# EAGLE design SwitchDemoWing (EAGLE 9.4.0)
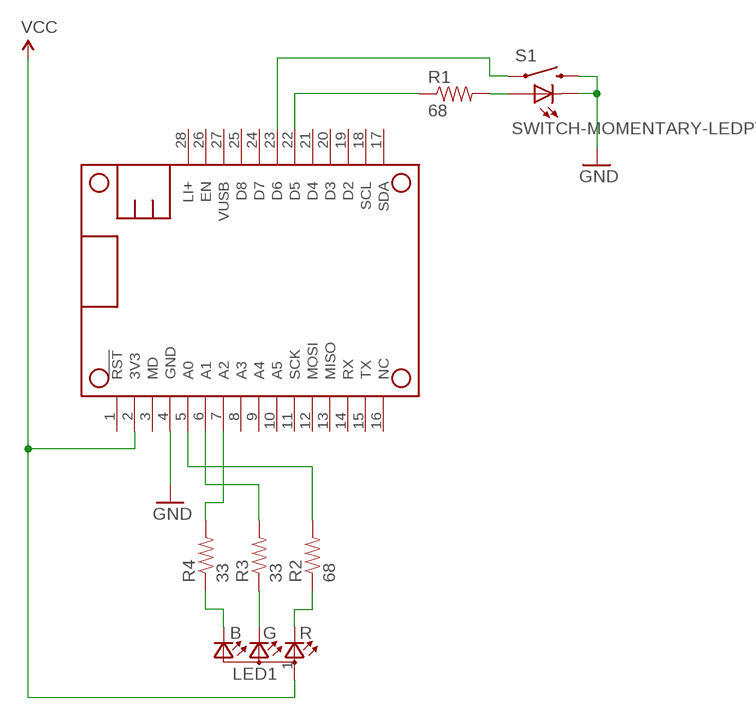
[diagram p0: schematic, sheet 1]

## Parts
LED1  LED-RGB-CREE-SMD  [LED-RGB-CREE-SMD]
MS1  PARTICLE_MESH_NODIM  [FEATHERWING_NODIM]
R1  68  RES-68-0603.DEV  [0603-RES]
R2  68  RES-68-0603.DEV  [0603-RES]
R3  33  RES-33-0603.DEV  [0603-RES]
R4  33  RES-33-0603.DEV  [0603-RES]
S1  SWITCH-MOMENTARY-LEDPTH  [TACTILE-PTH-LED-12MM]

## Nets
3V3: LED1.1(A) MS1.2(3V3) ; supply symbol labelled VCC
A0: MS1.5(A0) R2.2
A1: MS1.6(A1) R3.2
A2: MS1.7(A2) R4.2
D5: MS1.22(D5) R1.1
D6: MS1.23(D6) S1.4
GND: MS1.4(GND) S1.2 S1.C
LED-B: LED1.2(B) R4.1
LED-G: LED1.3(G) R3.1
LED-R: LED1.4(R) R2.1
N$1: R1.2 S1.A
Unconnected: MS1.1(!RST) MS1.3(MD) MS1.8(A3) MS1.9(A4) MS1.10(A5) MS1.11(SCK) MS1.12(MOSI) MS1.13(MISO) MS1.14(RX) MS1.15(TX) MS1.16(NC) MS1.17(SDA) MS1.18(SCL) MS1.19(D2) MS1.20(D3) MS1.21(D4) MS1.24(D7) MS1.25(D8) MS1.26(EN) MS1.27(VUSB) MS1.28(LI+)

## Library data of the parts
LED1 = rickk2:LED-RGB-CREE-SMD: LED RGB DIFFUSED 4SMD $ 0.35 Cree CLMVB-FKA-CFHEHLCBB7A363 2mm 4-PLCC common anode RGB LED https://www.digikey.com/product-detail/en/cree-inc/CLMVB-FKA-CFHEHLCBB7A363/CLMVB-FKA-CFHEHLCBB7A363CT-ND/6138627 Red=68 ohm, Green/Blue=33 ohm @ 3.3V
MS1 = Particle-Mesh:PARTICLE_MESH
R1 R2 = rickk2:RES-68-0603.DEV: https://www.digikey.com/product-detail/en/panasonic-electronic-components/ERJ-3EKF68R0V/P68.0HCT-ND/1746805 Panasonic SMD 0603 1% 1/10W
R3 R4 = rickk2:RES-33-0603.DEV: https://www.digikey.com/product-detail/en/panasonic-electronic-components/ERJ-3EKF33R0V/P33.0HCT-ND/1746765 Panasonic SMD 0603 1% 1/10W
S1 = SparkFun-Electromechanical:SWITCH-MOMENTARY-LED: EZ is for Kits. There is no tStop (covering up the top side of the pads with mask). This helps the beginner see which side they should be soldering too.

## Board
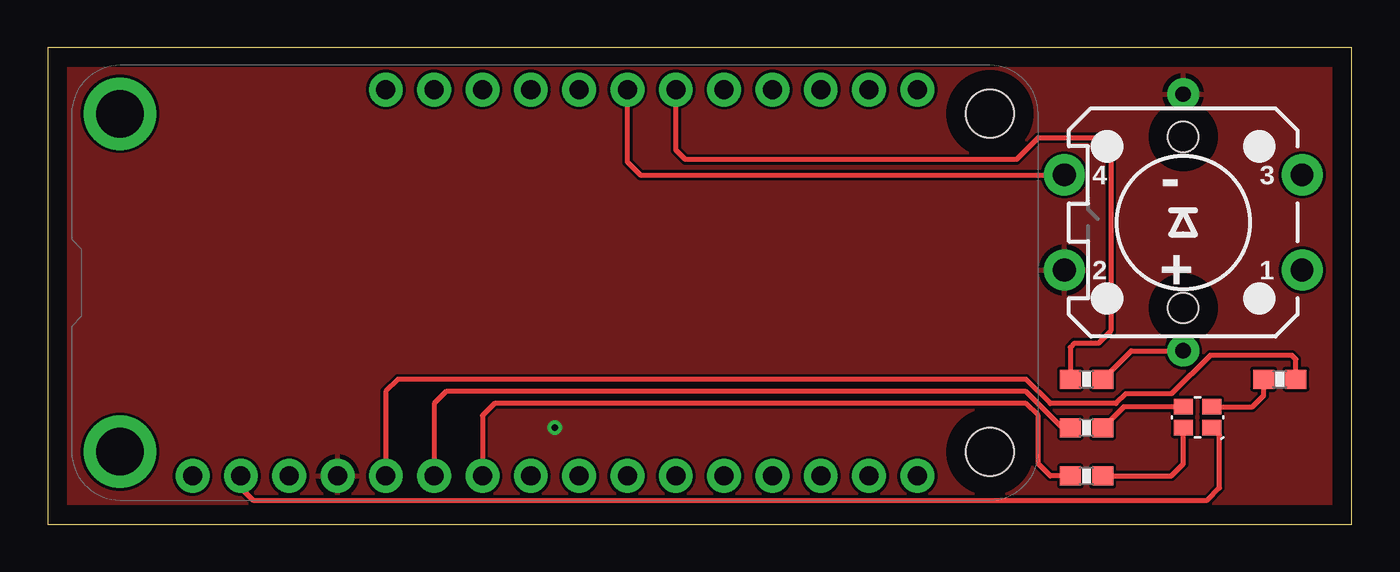
[diagram p1: board, top side]
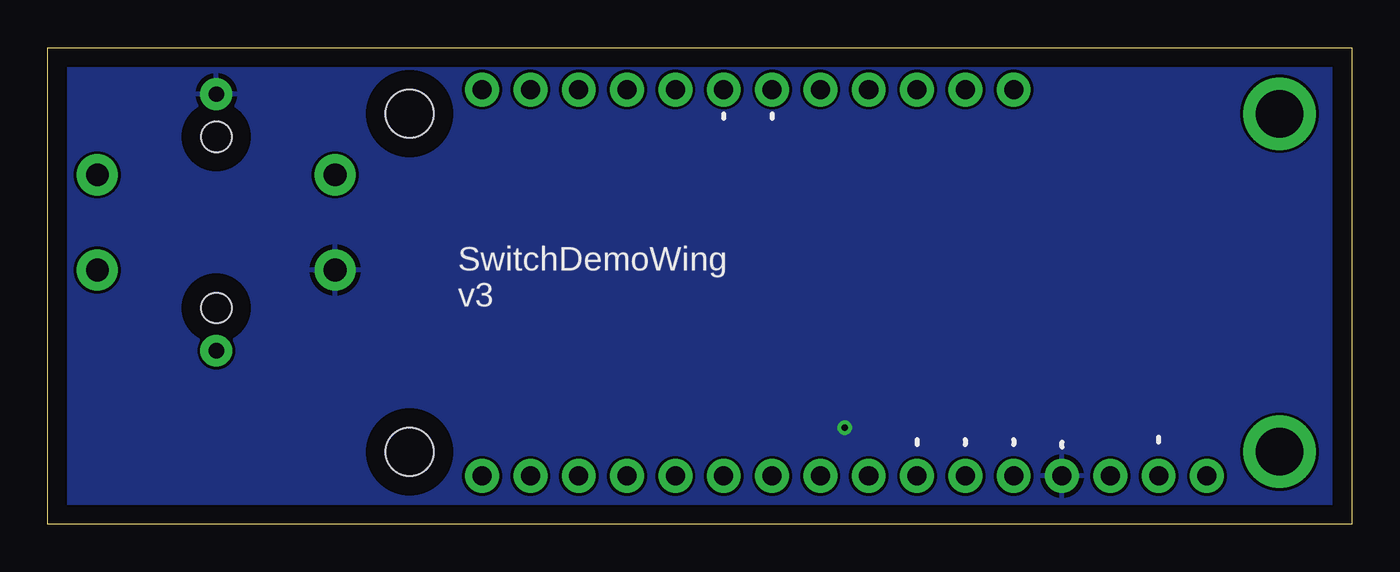
[diagram p2: board, bottom side, seen from below]

Size 68.56 x 25.07 mm. Coordinates in mm from the lower left corner, seen from the top.
Outline: 0,0 68.56,0 68.56,25.07 0,25.07 0,0
Copper layers (1*16): Top 0.035mm / dielectric 1.5mm / Bottom 0.035mm
Design rules "default": minimum track width 6mil, minimum drill 0.35mm, track to track 6mil, track to pad 6mil, pad to pad 6mil, via to via 6mil, smd to smd 6mil, copper to edge 40mil, drill to drill 6mil, minimum pad ring 10mil, minimum via ring 8mil, stop-mask expansion 4mil, vias tented up to drill 0mil, thermal gap 10mil

### Footprints (pad centres in the part's own frame; a part is rotated, then mirrored left to right if it is on the bottom)
LED-RGB-CREE-SMD = smd 1 x 0.8: 1 1.5,0; 2 0,0; 3 0,1.1; 4 1.5,1.1
FEATHERWING_NODIM = drill 1 pad 1.778: 1 6.35,1.27; 2 8.89,1.27; 3 11.43,1.27; 4 13.97,1.27; 5 16.51,1.27; 6 19.05,1.27; 7 21.59,1.27; 8 24.13,1.27; 9 26.67,1.27; 10 29.21,1.27; 11 31.75,1.27; 12 34.29,1.27; 13 36.83,1.27; 14 39.37,1.27; 15 41.91,1.27; 16 44.45,1.27; 17 44.45,21.59; 18 41.91,21.59; 19 39.37,21.59; 20 36.83,21.59; 21 34.29,21.59; 22 31.75,21.59; 23 29.21,21.59; 24 26.67,21.59; 25 24.13,21.59; 26 21.59,21.59; 27 19.05,21.59; 28 16.51,21.59 | drill 2.5 pad 3.81: P$1 2.54,20.32; P$2 2.54,2.54 | hole 2.54: 48.26,20.32; 48.26,2.54
0603-RES = smd 1.1 x 1: 1 -0.85,0; 2 0.85,0
TACTILE-PTH-LED-12MM = drill 1.2 pad 2.159: 1 -6.25,2.5; 2 6.25,2.5; 3 -6.25,-2.5; 4 6.25,-2.5 | drill 0.8 pad 1.676: A 0,6.75; C 0,-6.75 | hole 1.6: 0,4.5; 0,-4.5

### Placement (x,y rotation side)
LED1  59.69,5.08 0 top
MS1  1.27,1.27 0 top
R1  54.61,7.62 0 top
R2  64.77,7.62 0 top
R3  54.61,5.08 180 top
R4  54.61,2.54 180 top
S1  59.69,15.88 180 top

### Tracks (layer width: path | path; a pad name or v marks a point on that pad's centre or on a via)
3V3
  Top 0.254: MS1.2 10.16,1.91 10.79,1.27 60.96,1.27 61.59,1.91 61.59,4.67 LED1.1
A0
  Top 0.254: R2.2 65.62,8.68 65.41,8.89 61.1,8.89 59.07,6.86 56.66,6.86 56.16,6.35 52.7,6.35 51.44,7.62 18.41,7.62 17.78,6.99 MS1.5
A1
  Top 0.254: R3.2 53.34,5.08 51.44,6.99 20.95,6.99 20.32,6.35 MS1.6
A2
  Top 0.254: R4.2 52.7,2.54 52.07,3.17 52.07,5.71 51.44,6.35 23.5,6.35 22.86,5.71 MS1.7
D5
  Top 0.254: MS1.22 33.02,19.68 33.53,19.18 50.93,19.18 52.07,20.32 55.24,20.32 55.88,19.68 55.88,10.16 55.24,9.53 53.98,9.53 53.76,9.31 R1.1
D6
  Top 0.254: MS1.23 30.48,19.05 31.16,18.38 S1.4
GND  (via drill 0.35)
  other vias: 26.67,5.08
  pour Top: 0,0 0,25.4 68.58,25.4 68.58,0
  pour Bottom: 0,0 0,25.4 68.58,25.4 68.58,0
LED-B
  Top 0.254: R4.1 59.05,2.54 59.69,3.17 LED1.2
LED-G
  Top 0.254: LED1.3 56.56,6.18 R3.1
LED-R
  Top 0.254: LED1.4 63.33,6.18 63.92,6.77 R2.1
N$1
  Top 0.254: R1.2 56.97,9.12 S1.A

### Text on the board
bPlace: SwitchDemoWing / v3